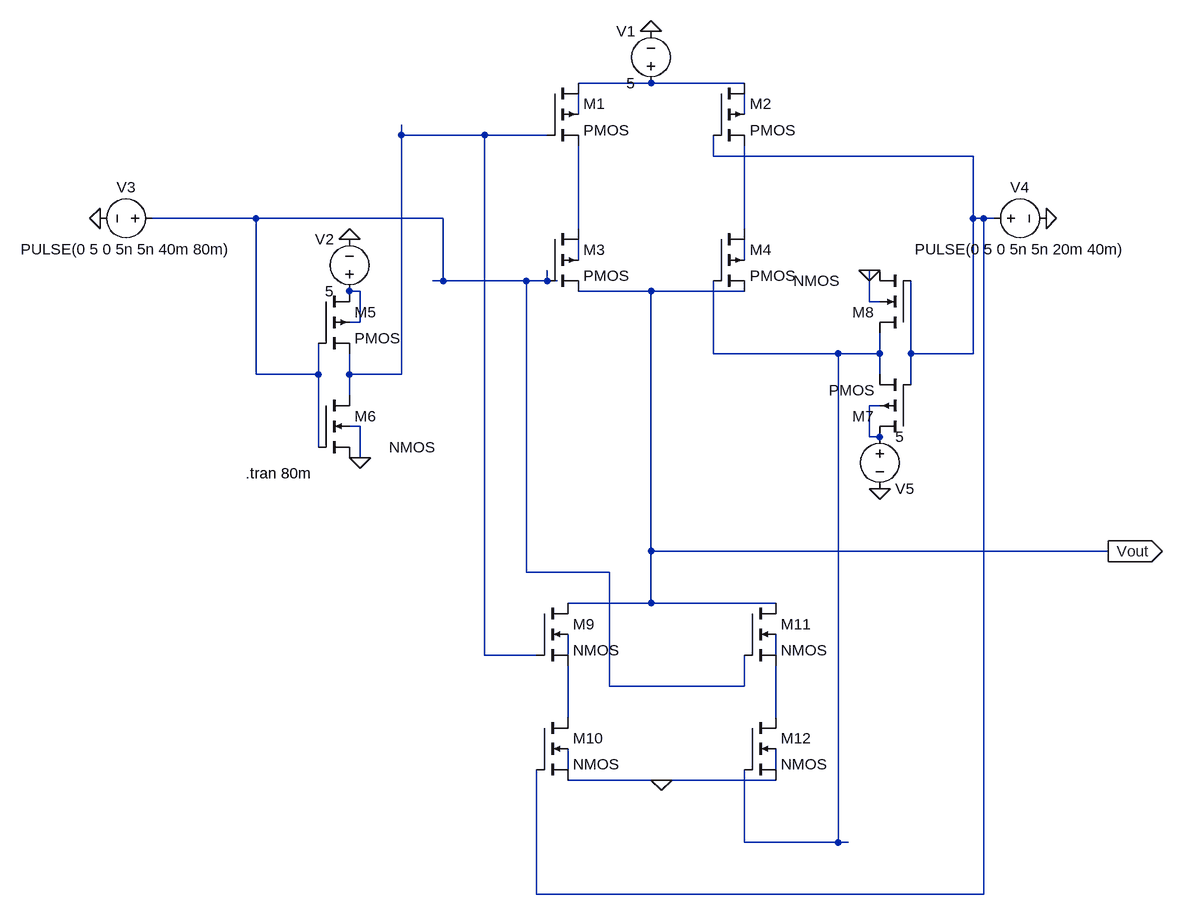
[diagram p0: schematic XNOR.asc]
XNOR.asc, the LTspice schematic file:
Version 4
SHEET 1 880 932
WIRE -656 -320 -768 -320
WIRE -512 -320 -656 -320
WIRE -768 -272 -768 -304
WIRE -512 -272 -512 -304
WIRE -1040 -240 -1040 -256
WIRE -912 -240 -1040 -240
WIRE -816 -240 -912 -240
WIRE -560 -208 -560 -240
WIRE -160 -208 -560 -208
WIRE -1264 -112 -1424 -112
WIRE -976 -112 -1264 -112
WIRE -160 -112 -160 -208
WIRE -144 -112 -160 -112
WIRE -128 -112 -144 -112
WIRE -768 -96 -768 -224
WIRE -512 -96 -512 -224
WIRE -768 -48 -768 -80
WIRE -512 -48 -512 -80
WIRE -304 -32 -320 -32
WIRE -976 -16 -976 -112
WIRE -976 -16 -992 -16
WIRE -848 -16 -976 -16
WIRE -816 -16 -816 -32
WIRE -816 -16 -848 -16
WIRE -800 -16 -816 -16
WIRE -1104 0 -1120 0
WIRE -656 0 -768 0
WIRE -512 0 -656 0
WIRE -320 16 -320 -32
WIRE -304 16 -320 16
WIRE -1104 48 -1104 0
WIRE -1104 48 -1120 48
WIRE -560 96 -560 -16
WIRE -368 96 -560 96
WIRE -304 96 -304 64
WIRE -304 96 -368 96
WIRE -256 96 -256 -16
WIRE -160 96 -160 -112
WIRE -160 96 -256 96
WIRE -1264 128 -1264 -112
WIRE -1168 128 -1168 80
WIRE -1168 128 -1264 128
WIRE -1120 128 -1120 96
WIRE -1040 128 -1040 -240
WIRE -1040 128 -1120 128
WIRE -304 128 -304 96
WIRE -256 144 -256 96
WIRE -1120 160 -1120 128
WIRE -304 176 -320 176
WIRE -1104 208 -1120 208
WIRE -320 224 -320 176
WIRE -304 224 -320 224
WIRE -1168 240 -1168 128
WIRE -1104 256 -1104 208
WIRE -1104 256 -1120 256
WIRE -656 400 -656 0
WIRE 48 400 -656 400
WIRE -848 432 -848 -16
WIRE -720 432 -848 432
WIRE -656 480 -656 400
WIRE -656 480 -784 480
WIRE -464 480 -656 480
WIRE -912 560 -912 -240
WIRE -832 560 -912 560
WIRE -784 560 -784 528
WIRE -464 560 -464 528
WIRE -720 608 -720 432
WIRE -512 608 -512 560
WIRE -512 608 -720 608
WIRE -784 656 -784 576
WIRE -464 656 -464 576
WIRE -784 736 -784 704
WIRE -464 736 -464 704
WIRE -640 752 -784 752
WIRE -464 752 -640 752
WIRE -512 848 -512 736
WIRE -368 848 -368 96
WIRE -368 848 -512 848
WIRE -352 848 -368 848
WIRE -832 928 -832 736
WIRE -144 928 -144 -112
WIRE -144 928 -832 928
FLAG -1104 256 0
FLAG -1120 -80 0
FLAG -656 -400 0
FLAG -48 -112 0
FLAG -1504 -112 0
FLAG -320 -32 0
FLAG -304 304 0
FLAG 48 400 Vout
IOPIN 48 400 Out
FLAG -640 752 0
DATAFLAG -160 -112 ""
SYMBOL pmos4 -816 -320 R0
SYMATTR InstName M1
SYMBOL pmos4 -560 -320 R0
SYMATTR InstName M2
SYMBOL pmos4 -816 -96 R0
SYMATTR InstName M3
SYMBOL pmos4 -560 -96 R0
SYMATTR InstName M4
SYMBOL pmos4 -1168 0 R0
SYMATTR InstName M5
SYMBOL nmos4 -1168 160 R0
WINDOW 3 109 80 Left 2
SYMATTR InstName M6
SYMBOL voltage -1120 16 R180
WINDOW 0 24 96 Left 2
WINDOW 3 24 16 Left 2
WINDOW 123 0 0 Left 0
WINDOW 39 0 0 Left 0
SYMATTR InstName V2
SYMATTR Value 5
SYMBOL voltage -656 -304 R180
WINDOW 0 24 96 Left 2
WINDOW 3 24 16 Left 2
WINDOW 123 0 0 Left 0
WINDOW 39 0 0 Left 0
SYMATTR InstName V1
SYMATTR Value 5
SYMBOL voltage -1408 -112 R90
WINDOW 0 -32 56 VBottom 2
WINDOW 3 32 56 VTop 2
WINDOW 123 0 0 Left 0
WINDOW 39 0 0 Left 0
SYMATTR InstName V3
SYMATTR Value PULSE(0 5 0 5n 5n 40m 80m)
SYMBOL voltage -144 -112 R270
WINDOW 0 32 56 VTop 2
WINDOW 3 -32 56 VBottom 2
WINDOW 123 0 0 Left 0
WINDOW 39 0 0 Left 0
SYMATTR InstName V4
SYMATTR Value PULSE(0 5 0 5n 5n 20m 40m)
SYMBOL pmos4 -256 224 R180
SYMATTR InstName M7
SYMBOL nmos4 -256 64 R180
WINDOW 3 109 80 Left 2
SYMATTR InstName M8
SYMBOL voltage -304 208 R0
WINDOW 0 24 96 Left 2
WINDOW 3 24 16 Left 2
WINDOW 123 0 0 Left 0
WINDOW 39 0 0 Left 0
SYMATTR InstName V5
SYMATTR Value 5
SYMBOL nmos4 -832 480 R0
SYMATTR InstName M9
SYMBOL nmos4 -832 656 R0
SYMATTR InstName M10
SYMBOL nmos4 -512 480 R0
SYMATTR InstName M11
SYMBOL nmos4 -512 656 R0
SYMATTR InstName M12
TEXT -1280 280 Left 2 !.tran 80m

The netlist it stands for:
* XNOR.asc
M1 N001 N004 N007 N002 PMOS
M2 N001 N005 N008 N003 PMOS
M3 N007 N006 Vout N009 PMOS
M4 N008 N012 Vout N010 PMOS
M5 N011 N006 N004 N011 PMOS
M6 N004 N006 0 0 NMOS
V2 N011 0 5
V1 N001 0 5
V3 N006 0 PULSE(0 5 0 5n 5n 40m 80m)
V4 N005 0 PULSE(0 5 0 5n 5n 20m 40m)
M7 N013 N005 N012 N013 PMOS
M8 N012 N005 0 0 NMOS
V5 N013 0 5
M9 Vout N004 N016 N014 NMOS
M10 N016 N005 0 N018 NMOS
M11 Vout N006 N017 N015 NMOS
M12 N017 N012 0 N019 NMOS
.model NMOS NMOS
.model PMOS PMOS
.lib standard.mos
.tran 80m
.backanno
.end